# EAGLE design v4.1 (EAGLE 6.3)
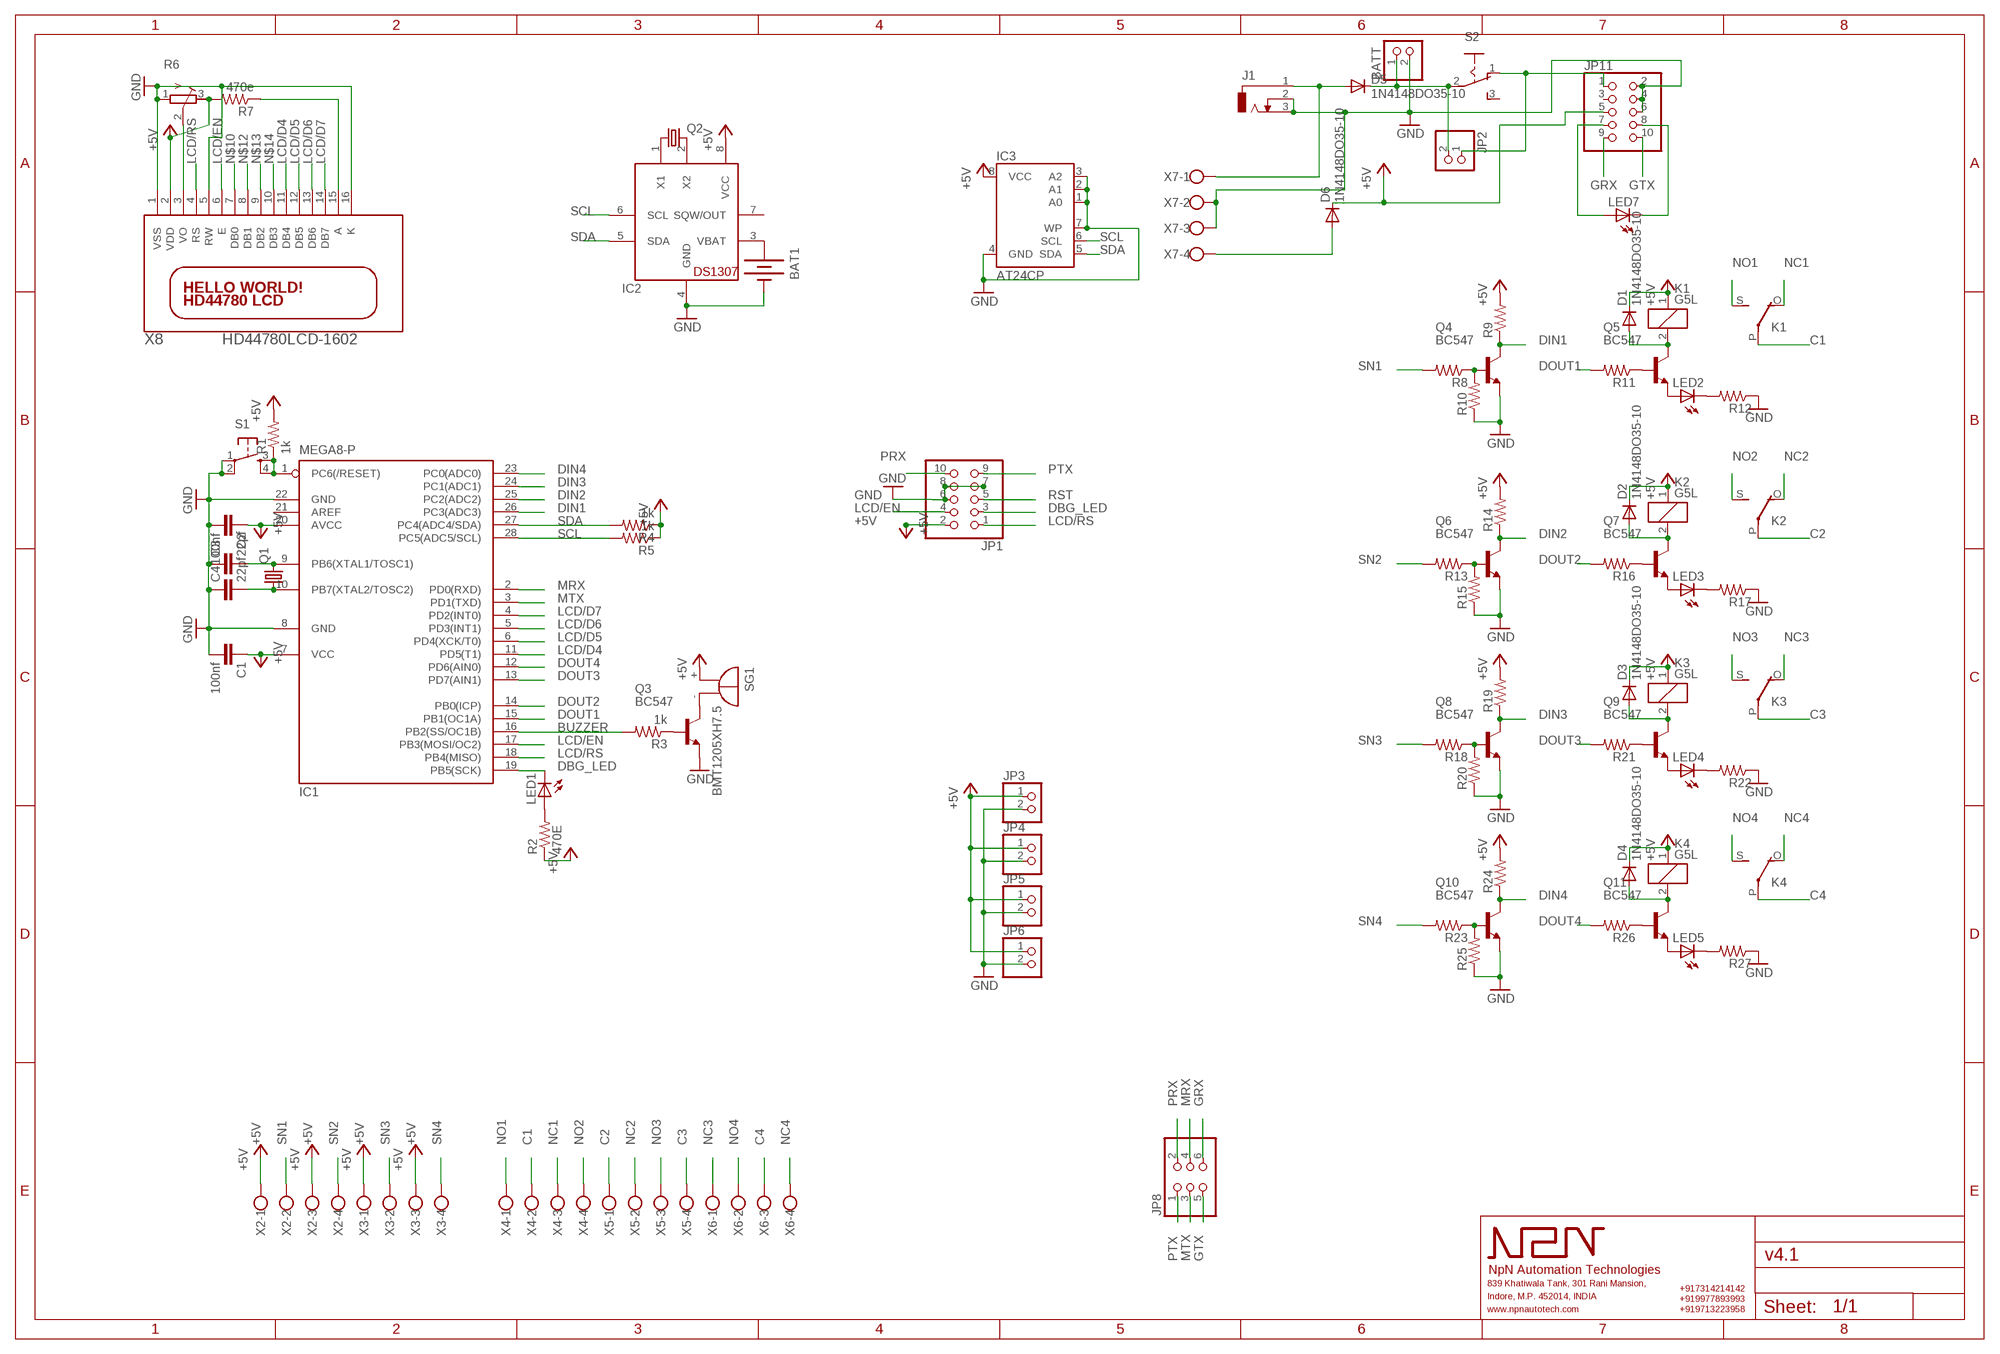
[diagram p0: schematic, sheet 1]

## Parts
BAT1  BATTERY20PTH  [BATTCOM_20MM_PTH]
BATT  PINHD-1X2  [1X02]
C1  100nf  C-EU050-025X075  [C050-025X075]
C2  100nf  C-EU050-025X075  [C050-025X075]
C3  22pf  C-EU050-025X075  [C050-025X075]
C4  22pf  C-EU050-025X075  [C050-025X075]
D1  1N4148DO35-10  [DO35-10]
D2  1N4148DO35-10  [DO35-10]
D3  1N4148DO35-10  [DO35-10]
D4  1N4148DO35-10  [DO35-10]
D5  1N4148DO35-10  [DO35-10]
D6  1N4148DO35-10  [DO35-10]
IC1  MEGA8-P  [DIL28-3]
IC2  DS1307  [DIL08]
IC3  AT24CP  [DIL08]
J1  DCJ0303  [DCJ0303]
JP1  PINHD-2X5/90  [2X05/90]
JP2  PINHD-1X2  [1X02]
JP3  PINHD-1X2  [1X02]
JP4  PINHD-1X2  [1X02]
JP5  PINHD-1X2  [1X02]
JP6  PINHD-1X2  [1X02]
JP8  PINHD-2X3/90  [2X03/90]
JP11  PINHD-2X5  [2X05]
K1  G5L  [G5LE]
K2  G5L  [G5LE]
K3  G5L  [G5LE]
K4  G5L  [G5LE]
LED1  LED5MM  [LED5MM]
LED2  LED5MM  [LED5MM]
LED3  LED5MM  [LED5MM]
LED4  LED5MM  [LED5MM]
LED5  LED5MM  [LED5MM]
LED7  LED5MM  [LED5MM]
Q1  CRYSTALHC49U-V  [HC49U-V]
Q2  CRYSTALTC38H  [TC38H]
Q3  BC547  [TO92]
Q4  BC547  [TO92]
Q5  BC547  [TO92]
Q6  BC547  [TO92]
Q7  BC547  [TO92]
Q8  BC547  [TO92]
Q9  BC547  [TO92]
Q10  BC547  [TO92]
Q11  BC547  [TO92]
R1  1k  R-US_0207/10  [0207/10]
R2  470E  R-US_0207/10  [0207/10]
R3  1k  R-US_0207/10  [0207/10]
R4  1k  R-US_0207/10  [0207/10]
R5  1k  R-US_0207/10  [0207/10]
R6  R-TRIMM3339P  [RTRIM3339P]
R7  470e  R-US_0207/10  [0207/10]
R8  R-US_0207/10  [0207/10]
R9  R-US_0207/10  [0207/10]
R10  R-US_0207/10  [0207/10]
R11  R-US_0207/10  [0207/10]
R12  R-US_0207/10  [0207/10]
R13  R-US_0207/10  [0207/10]
R14  R-US_0207/10  [0207/10]
R15  R-US_0207/10  [0207/10]
R16  R-US_0207/10  [0207/10]
R17  R-US_0207/10  [0207/10]
R18  R-US_0207/10  [0207/10]
R19  R-US_0207/10  [0207/10]
R20  R-US_0207/10  [0207/10]
R21  R-US_0207/10  [0207/10]
R22  R-US_0207/10  [0207/10]
R23  R-US_0207/10  [0207/10]
R24  R-US_0207/10  [0207/10]
R25  R-US_0207/10  [0207/10]
R26  R-US_0207/10  [0207/10]
R27  R-US_0207/10  [0207/10]
S1  TAC_SWITCHPTH  [TACTILE-PTH]
S2  M251  [M251]
SG1  BMT1205XH7.5  [BMT1205XH7.5]
X2  W237-4  [W237-4]
X3  W237-4  [W237-4]
X4  W237-4  [W237-4]
X5  W237-4  [W237-4]
X6  W237-4  [W237-4]
X7  W237-4  [W237-4]
X8  HD44780LCD-1602  [LCD1602]

## Nets
+5V: C1.1 C2.1 D1.C D2.C D3.C D4.C D6.C IC1.7(VCC) IC1.20(AVCC) IC2.8(VCC) IC3.8(VCC) JP1.2 JP3.1 JP4.1 JP5.1 JP6.1 JP11.5 K1.1 K2.1 K3.1 K4.1 R1.2 R2.1 R4.1 R5.1 R9.2 R14.2 R19.2 R24.2 SG1.+ X2.1 X2.3 X3.1 X3.3
BUZZER: IC1.16(PB2(SS/OC1B)) R3.2
C1: K1.P(2:P) X4.2
C2: K2.P(2:P) X5.1
C3: K3.P(2:P) X5.4
C4: K4.P(2:P) X6.3
DBG_LED: IC1.19(PB5(SCK)) JP1.3 LED1.K(C)
DIN1: IC1.26(PC3(ADC3)) Q4.3(C) R9.1
DIN2: IC1.25(PC2(ADC2)) Q6.3(C) R14.1
DIN3: IC1.24(PC1(ADC1)) Q8.3(C) R19.1
DIN4: IC1.23(PC0(ADC0)) Q10.3(C) R24.1
DOUT1: IC1.15(PB1(OC1A)) R11.2
DOUT2: IC1.14(PB0(ICP)) R16.2
DOUT3: IC1.13(PD7(AIN1)) R21.2
DOUT4: IC1.12(PD6(AIN0)) R26.2
GND: BAT1.2(-) BATT.2 C1.2 C2.2 C3.1 C4.1 IC1.8(GND) IC1.22(GND) IC2.4(GND) IC3.1(A0) IC3.2(A1) IC3.3(A2) IC3.4(GND) IC3.7(WP) J1.2 J1.3 JP1.6 JP1.7 JP1.8 JP3.2 JP4.2 JP5.2 JP6.2 JP11.2 JP11.4 JP11.6 Q3.1(E) Q4.1(E) Q6.1(E) Q8.1(E) Q10.1(E) R10.1 R12.1 R15.1 R17.1 R20.1 R22.1 R25.1 R27.1 S1.1 S1.2 X7.2 X7.3
GRX: JP8.6 JP11.9
GTX: JP8.5 JP11.10
LCD/D4: IC1.11(PD5(T1)) X8.11(DB4)
LCD/D5: IC1.6(PD4(XCK/T0)) X8.12(DB5)
LCD/D6: IC1.5(PD3(INT1)) X8.13(DB6)
LCD/D7: IC1.4(PD2(INT0)) X8.14(DB7)
LCD/EN: IC1.17(PB3(MOSI/OC2)) JP1.4 X8.6(E)
LCD/RS: IC1.18(PB4(MISO)) JP1.1 X8.4(RS)
MRX: IC1.2(PD0(RXD)) JP8.4
MTX: IC1.3(PD1(TXD)) JP8.3
N$1: IC2.2(X2) Q2.2
N$2: R7.1 X8.15(A)
N$3: IC2.1(X1) Q2.1
N$4: LED1.A R2.2
N$5: C3.2 IC1.9(PB6(XTAL1/TOSC1)) Q1.2
N$6: C4.2 IC1.10(PB7(XTAL2/TOSC2)) Q1.1
N$7: Q3.2(B) R3.1
N$8: Q3.3(C) SG1.-
N$9: R6.2(S) X8.3(VO)
N$10: X8.7(DB0)
N$11: BAT1.1(+) IC2.3(VBAT)
N$12: X8.8(DB1)
N$13: X8.9(DB2)
N$14: X8.10(DB3)
N$15: D6.A X7.4
N$16: Q4.2(B) R8.1 R10.2
N$17: JP2.1 JP11.1 S2.1(O)
N$18: Q5.2(B) R11.1
N$19: LED2.A Q5.1(E)
N$20: LED2.K(C) R12.2
N$21: D1.A K1.2 Q5.3(C)
N$22: D5.A J1.1 X7.1
N$23: BATT.1 D5.C JP2.2 S2.2(P)
N$27: Q6.2(B) R13.1 R15.2
N$28: Q7.2(B) R16.1
N$29: LED3.A Q7.1(E)
N$30: LED3.K(C) R17.2
N$31: D2.A K2.2 Q7.3(C)
N$32: Q8.2(B) R18.1 R20.2
N$33: Q9.2(B) R21.1
N$34: LED4.A Q9.1(E)
N$35: LED4.K(C) R22.2
N$36: D3.A K3.2 Q9.3(C)
N$37: Q10.2(B) R23.1 R25.2
N$38: Q11.2(B) R26.1
N$39: LED5.A Q11.1(E)
N$40: LED5.K(C) R27.2
N$41: D4.A K4.2 Q11.3(C)
N$50: JP11.7 LED7.A
N$51: JP11.8 LED7.K(C)
NC1: K1.O(2:O) X4.3
NC2: K2.O(2:O) X5.2
NC3: K3.O(2:O) X6.1
NC4: K4.O(2:O) X6.4
NO1: K1.S(2:S) X4.1
NO2: K2.S(2:S) X4.4
NO3: K3.S(2:S) X5.3
NO4: K4.S(2:S) X6.2
PRX: JP1.10 JP8.2
PTX: JP1.9 JP8.1
RST: IC1.1(PC6(/RESET)) JP1.5 R1.1 S1.3 S1.4
SCL: IC1.28(PC5(ADC5/SCL)) IC2.6(SCL) IC3.6(SCL) R5.2
SDA: IC1.27(PC4(ADC4/SDA)) IC2.5(SDA) IC3.5(SDA) R4.2
SN1: R8.2 X2.2
SN2: R13.2 X2.4
SN3: R18.2 X3.2
SN4: R23.2 X3.4
VDD: R6.3(E) R7.2 X8.2(VDD) ; supply symbol labelled +5V
VSS: R6.1(A) X8.1(VSS) X8.5(RW) X8.16(K) ; supply symbol labelled GND
Unconnected: IC1.21(AREF) IC2.7(SQW/OUT) JP11.3 S2.3(S)

## Library data of the parts
BAT1 = SparkFun-Electromechanical:BATTERY: Battery Holders Various common sizes : AA, AAA, 20mm coin cell and 12mm coin cell. 20MM_4LEGS, BATT-10373
BATT JP2-JP6 = pinhead:PINHD-1X2: PIN HEADER
C1-C4 = rcl:C-EU: CAPACITOR, European symbol
D1-D6 = diode:1N4148: DIODE high speed (Philips)
IC1 = atmel:MEGA8-P: MICROCONTROLLER 8 Kbytes FLASH, 1 kbytes SRAM, 512 bytes EEPROM, USART, 4-channel 10 bit ADC, 2-channel 8 bit ADC Pin compatible with Atmega48, ATMega88, ATMega168 Source: avr.lbr; OC_FARNELL: unknown; OC_NEWARK: unknown
IC2 = adafruit:DS1307: DS1307 Real time clock (RTC) with battery backup ability. Talk to it via i2c
IC3 = atmel:AT24C*: 2-wire serial EEPROM; MPN: AT24C1024BW-SH-B; OC_FARNELL: 1362646; OC_NEWARK: 03P2044
J1 = con-jack:DCJ0303: DC POWER JACK Source: DCJ0303.pdf; OC_FARNELL: unknown; OC_NEWARK: unknown
JP1 JP11 = pinhead:PINHD-2X5: PIN HEADER
JP8 = pinhead:PINHD-2X3: PIN HEADER
K1-K4 = relay:G5L: RELAY 1 x switch, 10 A/120 V AC, 8 A/30 V ADC, Omron; OC_FARNELL: unknown; OC_NEWARK: unknown
LED1-LED5 LED7 = led:LED: LED OSRAM: - CHIPLED LG R971, LG N971, LY N971, LG Q971, LY Q971, LO R971, LY R971 LH N974, LH R974 LS Q976, LO Q976, LY Q976 LO Q996 - Hyper CHIPLED LW Q18S LB Q993, LB Q99A, LB R99A - SideLED LS A670, LO A670, LY A670, LG A670, LP A670 LB A673, LV A673, LT A673, LW A673 LH A674 LY A675 LS A676, LA A676, LO A676, LY A676, LW A676 LS A679, LY A679, LG A679 - Hyper Micro SIDELED® LS Y876, LA Y876, LO Y876, LY Y876 LT Y87S - SmartLED LW L88C, LW L88S LB L89C, LB L89S, LG L890 LS L89K, LO L89K, LY L89K LS L896, LA L896, LO L896, LY L896 - TOPLED LS T670, LO T670, LY T670, LG T670, LP T670 LSG T670, LSP T670, LSY T670, LOP T670, LYG T670 LG T671, LOG T671, LSG T671 LB T673, LV T673, LT T673, LW T673 LH T674 LS T676, LA T676, LO T676, LY T676, LB T676, LH T676, LSB T676, LW T676 LB T67C, LV T67C, LT T67C, LS T67K, LO T67K, LY T67K, LW E67C LS E67B, LA E67B, LO E67B, LY E67B, LB E67C, LV E67C, LT E67C LW T67C LS T679, LY T679, LG T679 LS T770, LO T770, LY T770, LG T770, LP T770 LB T773, LV T773, LT T773, LW T773 LH T774 LS E675, LA E675, LY E675, LS T675 LS T776, LA T776, LO T776, LY T776, LB T776 LHGB T686 LT T68C, LB T68C - Hyper Mini TOPLED® LB M676 - Mini TOPLED Santana® LG M470 LS M47K, LO M47K, LY M47K Source: http://www.osram.convergy.de LUXEON: - LUMILED® LXK2-PW12-R00, LXK2-PW12-S00, LXK2-PW14-U00, LXK2-PW14-V00 LXK2-PM12-R00, LXK2-PM12-S00, LXK2-PM14-U00 LXK2-PE12-Q00, LXK2-PE12-R00, LXK2-PE12-S00, LXK2-PE14-T00, LXK2-PE14-U00 LXK2-PB12-K00, LXK2-PB12-L00, LXK2-PB12-M00, LXK2-PB14-N00, LXK2-PB14-P00, LXK2-PB14-Q00 LXK2-PR12-L00, LXK2-PR12-M00, LXK2-PR14-Q00, LXK2-PR14-R00 LXK2-PD12-Q00, LXK2-PD12-R00, LXK2-PD12-S00 LXK2-PH12-R00, LXK2-PH12-S00 LXK2-PL12-P00, LXK2-PL12-Q00, LXK2-PL12-R00 Source: www.luxeon.com KINGBRIGHT: KA-3528ASYC Source: www.kingbright.com
Q1 = crystal:CRYSTAL: CRYSTAL; OC_FARNELL: 1666969; OC_NEWARK: unknown
Q2 = crystal:CRYSTAL: CRYSTAL; OC_FARNELL: unknown; OC_NEWARK: unknown
Q3-Q11 = transistor-npn:BC547*: NPN Transistor
R1-R5 R7-R27 = rcl:R-US_: RESISTOR, American symbol
R6 = rcl:R-TRIMM: Trimm resistor
S1 = SparkFun-Electromechanical:TAC_SWITCH: Momentary Switch Button commonly used for reset or general input. Spark Fun Electronics SKU : COM-00097 SMT- SWCH-08247
S2 = switch:M251: SLIDING SWITCH Mors, distributor Buerklin, 11G702
SG1 = buzzer:BMT1205XH7.5: MAGNETIC TRANSDUCER Source: Http:www.be-star.com; OC_FARNELL: unknown; OC_NEWARK: unknown
X2-X7 = con-wago-500:W237-4: WAGO SCREW CLAMP; OC_FARNELL: unknown; OC_NEWARK: unknown
X8 = adafruit_NPN:HD44780LCD: HD44780 LCD Standard character type LCDs, available in sizes from 8x1 to 40x4!

## Board
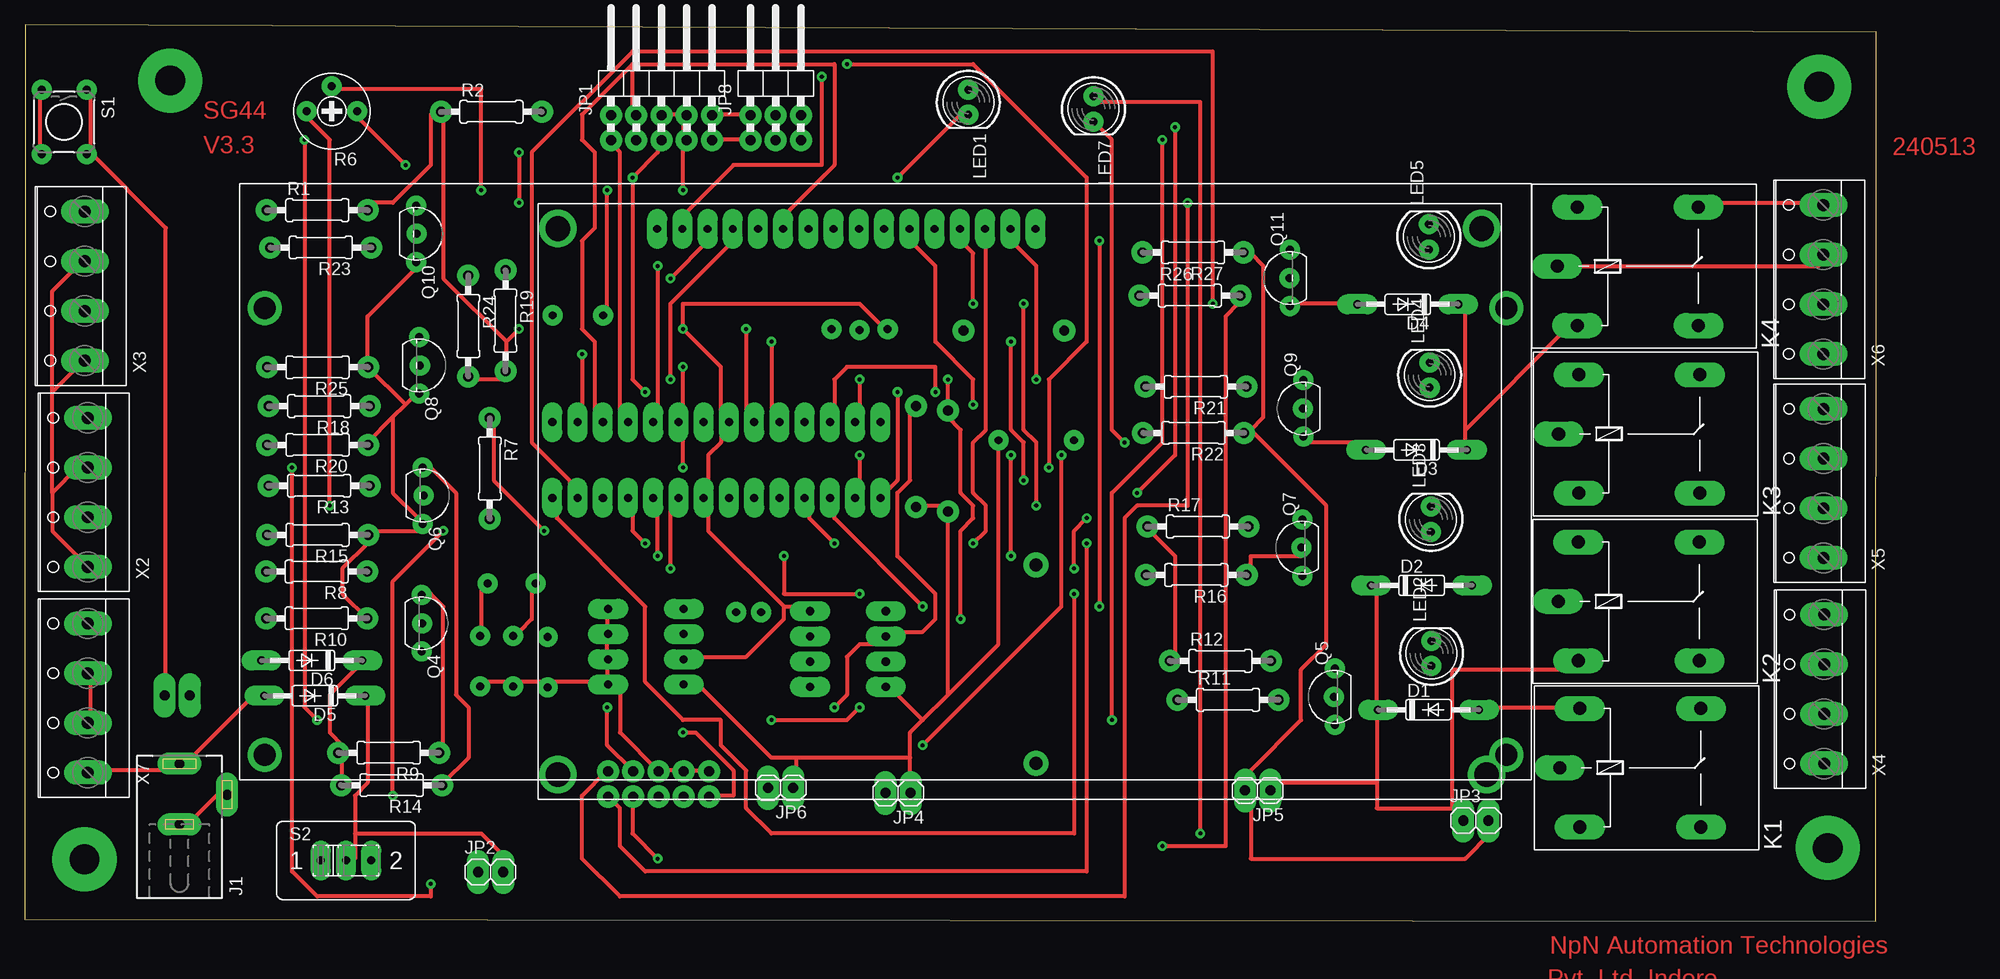
[diagram p1: board, top side]
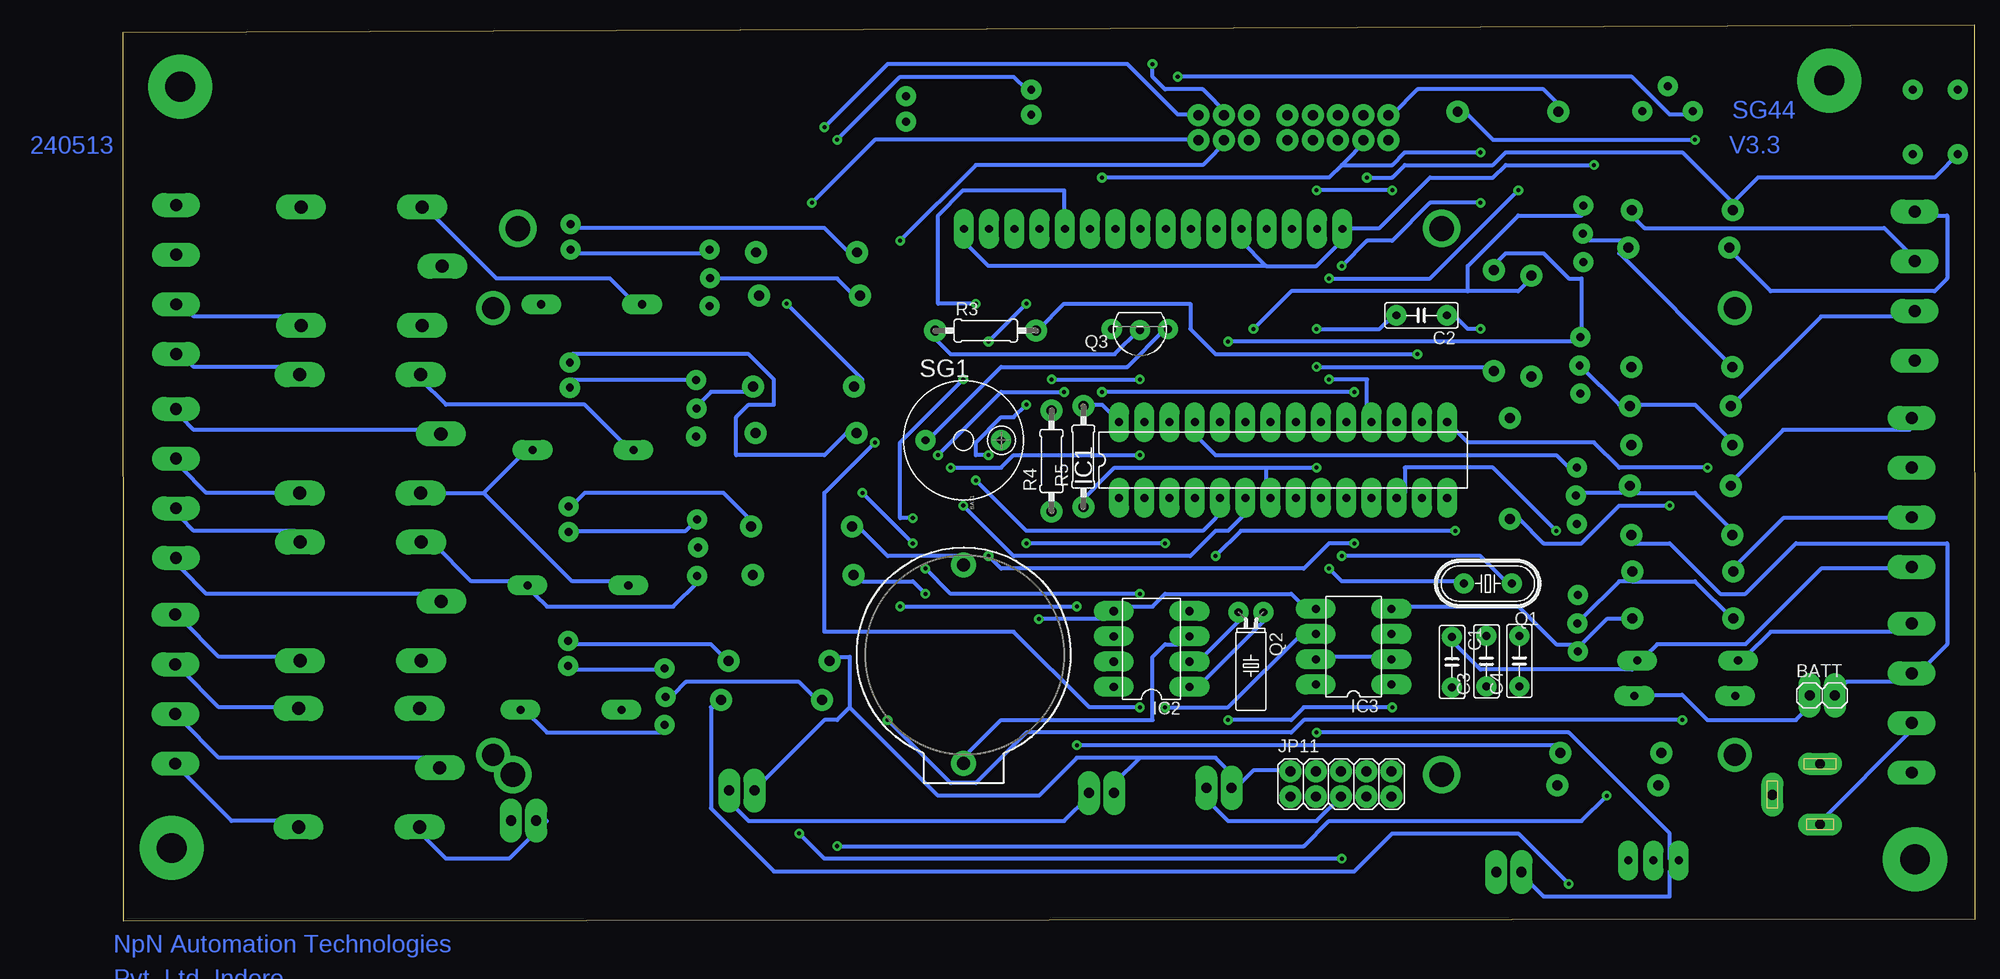
[diagram p2: board, bottom side, seen from below]

Size 186.4 x 90.27 mm. Coordinates in mm from the lower left corner, seen from the top.
Outline: 0,0.18 186.35,0 186.4,89.5 0.05,90.27 0,0.18
Copper layers (1*16): Top 0.035mm / dielectric 1.5mm / Bottom 0.035mm
Design rules: minimum track width 16mil, minimum drill 16mil, track to track 16mil, track to pad 16mil, pad to pad 16mil, via to via 16mil, smd to smd 16mil, copper to edge 40mil, drill to drill 16mil, minimum pad ring 24mil, minimum via ring 11mil, stop-mask expansion 16mil, vias tented up to drill 0mil, thermal gap 16mil

### Footprints (pad centres in the part's own frame; a part is rotated, then mirrored left to right if it is on the bottom)
BATTCOM_20MM_PTH = drill 1.3: 1 20,0; 2 0,0
1X02 = drill 1.016 long: 1 -1.27,0; 2 1.27,0
C050-025X075 = drill 0.8 pad 1.93: 1 -2.54,0; 2 2.54,0
DO35-10 = drill 0.813 long: A 5.08,0; C -5.08,0
DIL28-3 = drill 0.813 long: 1 -16.51,-3.81; 2 -13.97,-3.81; 3 -11.43,-3.81; 4 -8.89,-3.81; 5 -6.35,-3.81; 6 -3.81,-3.81; 7 -1.27,-3.81; 8 1.27,-3.81; 9 3.81,-3.81; 10 6.35,-3.81; 11 8.89,-3.81; 12 11.43,-3.81; 13 13.97,-3.81; 14 16.51,-3.81; 15 16.51,3.81; 16 13.97,3.81; 17 11.43,3.81; 18 8.89,3.81; 19 6.35,3.81; 20 3.81,3.81; 21 1.27,3.81; 22 -1.27,3.81; 23 -3.81,3.81; 24 -6.35,3.81; 25 -8.89,3.81; 26 -11.43,3.81; 27 -13.97,3.81; 28 -16.51,3.81
DIL08 = drill 0.813 long: 1 -3.81,-3.81; 2 -1.27,-3.81; 3 1.27,-3.81; 4 3.81,-3.81; 5 3.81,3.81; 6 1.27,3.81; 7 -1.27,3.81; 8 -3.81,3.81
DCJ0303 = drill 1 pad 2 long: 1 0,3.1; 2 4.8,0; 3 0,-3
2X05/90 = drill 1 pad 2.184: 1 -5.08,-6.35; 2 -5.08,-3.81; 3 -2.54,-6.35; 4 -2.54,-3.81; 5 0,-6.35; 6 0,-3.81; 7 2.54,-6.35; 8 2.54,-3.81; 9 5.08,-6.35; 10 5.08,-3.81
2X03/90 = drill 1 pad 2.184: 1 -2.54,-6.35; 2 -2.54,-3.81; 3 0,-6.35; 4 0,-3.81; 5 2.54,-6.35; 6 2.54,-3.81
2X05 = drill 1 pad 2.184: 1 -5.08,-1.27; 2 -5.08,1.27; 3 -2.54,-1.27; 4 -2.54,1.27; 5 0,-1.27; 6 0,1.27; 7 2.54,-1.27; 8 2.54,1.27; 9 5.08,-1.27; 10 5.08,1.27
G5LE = drill 1.321 long: 1 -7.493,-5.969; 2 -7.493,5.969; O 4.699,5.969; P -9.525,0; S 4.699,-5.969
LED5MM = drill 0.8 pad 1.778: A -1.27,0; K 1.27,0
HC49U-V = drill 0.8 pad 1.93: 1 -2.413,0; 2 2.413,0
TC38H = drill 0.8 pad 1.93: 1 -1.27,0; 2 1.27,0
TO92 = drill 0.8 pad 1.93: 1 2.84,0; 2 0,0.075; 3 -2.84,0
0207/10 = drill 1 pad 2.184: 1 -5.08,0; 2 5.08,0
RTRIM3339P = drill 0.8 pad 1.93: 1 -2.54,0; 2 0,-2.54; 3 2.54,0
TACTILE-PTH = drill 0.8 pad 1.93: 1 -3.251,2.261; 2 3.251,2.261; 3 -3.251,-2.261; 4 3.251,-2.261
M251 = drill 0.813 long: 1 -2.54,0; 2 0,0; 3 2.54,0
BMT1205XH7.5 = drill 0.8 pad 1.93: + 3.8,0; - -3.8,0
SIM300_OUTLINE = drill 2.2: P$1 2.5,2.5; P$2 2.5,47.5; P$3 127.5,2.5; P$4 127.5,47.5
W237-4 = drill 1.194 long: 1 -7.5,-1.27; 2 -2.5,-1.27; 3 2.5,-1.27; 4 7.5,-1.27
LCD1602 = drill 0.8 long: 1 12,57.96; 2 14.54,57.96; 3 17.08,57.96; 4 19.62,57.96; 5 22.16,57.96; 6 24.7,57.96; 7 27.24,57.96; 8 29.78,57.96; 9 32.32,57.96; 10 34.86,57.96; 11 37.4,57.96; 12 39.94,57.96; 13 42.48,57.96; 14 45.02,57.96; 15 47.56,57.96; 16 50.1,57.96 | drill 2.5: P$1 2,58; P$2 95,58; P$3 2,3; P$4 95.5,3

### Placement (x,y rotation side)
BAT1  101.77,35.89 270 bottom
BATT  15.35,22.74 0 bottom
C1  52.61,26.1 270 bottom
C2  55.69,61.02 180 bottom
C3  49.14,26.18 90 bottom
C4  45.83,26.2 90 bottom
D1  141.31,21.31 0 top
D2  140.61,33.82 0 top
D3  140.1,47.47 180 top
D4  139.22,62.13 180 top
D5  29.19,22.71 180 top
D6  28.9,26.26 180 top
IC1  69.62,46.45 0 bottom
IC2  82.86,27.42 90 bottom
IC3  62.52,27.65 90 bottom
J1  15.56,12.75 0 top
JP1  64.09,85 0 top
JP2  46.89,4.96 0 top
JP3  146.08,10.14 0 top
JP4  87.91,12.91 180 top
JP5  124.11,13.16 180 top
JP6  76.08,13.43 180 top
JP8  75.59,85 0 top
JP11  63.78,13.83 0 bottom
K1  164.04,15.46 0 top
K2  163.89,32.21 0 top
K3  163.93,49.08 0 top
K4  163.79,65.96 0 top
LED1  94.98,82.47 270 top
LED2  141.62,26.97 90 top
LED3  141.55,40.48 90 top
LED4  141.42,54.99 90 top
LED5  141.34,68.92 90 top
LED7  107.58,81.8 270 top
Q1  49.01,34.01 180 bottom
Q2  72.85,31.13 180 bottom
Q3  84.03,59.63 180 bottom
Q4  39.93,30.01 270 top
Q5  131.87,22.6 90 top
Q6  40.06,42.87 270 top
Q7  128.59,37.62 90 top
Q8  39.7,55.98 270 top
Q9  128.74,51.64 90 top
Q10  39.38,69.23 270 top
Q11  127.37,64.78 90 top
R1  29.45,71.6 0 top
R2  46.97,81.51 0 top
R3  99.56,59.48 0 bottom
R4  92.93,46.35 90 bottom
R5  89.73,46.78 90 bottom
R6  30.91,81.57 180 top
R7  46.81,45.59 270 top
R8  29.39,35.22 180 top
R9  36.63,16.98 180 top
R10  29.4,30.51 180 top
R11  121.13,22.3 0 top
R12  120.35,26.23 0 top
R13  29.63,43.86 180 top
R14  36.92,13.71 180 top
R15  29.47,38.91 180 top
R16  117.93,34.86 180 top
R17  118.08,39.75 0 top
R18  29.64,51.88 180 top
R19  48.39,60.48 270 top
R20  29.48,47.98 180 top
R21  117.88,53.83 180 top
R22  117.65,49.19 180 top
R23  29.8,67.85 180 top
R24  44.65,59.94 270 top
R25  29.47,55.79 180 top
R26  117.28,63 0 top
R27  117.6,67.36 180 top
S1  3.95,80.48 270 top
S2  32.33,6.12 0 top
SG1  101.8,48.43 0 bottom
U$1  SIM300_OUTLINE  [SIM300_OUTLINE]  21.65,14.26 0 top
X2  5.07,43.18 90 top
X3  4.77,63.96 90 top
X4  179.87,23.38 90 top
X5  179.8,44.09 90 top
X6  179.79,64.62 90 top
X7  5.07,22.48 90 top
X8  51.65,11.76 0 top

### Tracks (layer width: path | path; a pad name or v marks a point on that pad's centre or on a via)
+5V  (via drill 0.41)
  Top 0.406: R14.2 31.97,13.92 31.97,16.46 R9.2 31.97,17.73 30.7,19 30.7,22.81 33.24,25.35 D6.C | 2.76,43.13 2.76,39.32 5.3,36.78 X2.1 | 2.76,43.13 5.3,45.67 X2.3 | 2.76,53.29 5.3,55.83 X3.1 | 2.76,43.13 2.76,53.29 | 2.76,53.29 2.76,63.45 5.3,65.99 X3.3 | 48.48,58.37 v49.75,59.64 | 48.48,58.37 48.48,55.83 R19.2 48.48,54.56 44.67,54.56 R24.2 | R1.2 34.51,72.34 37.05,72.34 40.86,76.15 40.86,81.23 R2.1 42.13,81.23 42.13,64.72 48.48,58.37 | v66.26,45.67 66.26,49.48 IC1.20 66.26,50.75 v66.26,55.83 | R5.1 90.39,41.86 92.93,41.86 R4.1 92.93,40.59 92.93,22.81 | 77.69,16.46 75.15,16.46 67.53,24.08 IC3.8 | 77.69,16.46 77.69,13.92 JP6.1 | 90.39,20.27 89.12,19 89.12,16.46 | 90.39,20.27 92.93,22.81 | 92.93,22.81 98.01,27.89 98.01,48.21 SG1.+ | 89.12,16.46 89.12,13.92 JP4.1 | 90.39,20.27 87.85,22.81 IC2.8 | 89.12,16.46 77.69,16.46 | 145,49.48 145,48.21 D3.C | 145,49.48 145,62.18 D4.C | 145,49.48 155.16,59.64 K4.1 | 136.11,21.54 136.11,32.97 D2.C | 136.11,13.92 125.95,13.92 JP5.1 | 136.11,21.54 136.11,13.92 | 136.11,21.54 D1.C | 143.73,11.38 136.11,11.38 136.11,13.92 | 143.73,11.38 143.73,25.35 155.16,25.35 K2.1 | 143.73,11.38 JP3.1
  Bottom 0.406: C1.1 52.29,27.89 49.75,25.35 34.51,25.35 D6.C 33.24,26.62 31.97,27.89 23.08,27.89 15.46,35.51 6.57,35.51 X2.1 | v49.75,59.64 51.02,59.64 52.29,60.91 C2.1 | JP1.2 58.64,81.23 56.1,83.77 43.4,83.77 42.13,82.5 R2.1 | X3.3 6.57,67.26 9.11,69.8 33.24,69.8 34.51,71.07 R1.2 | 71.34,45.67 71.34,43.13 IC1.7 | 71.34,45.67 86.58,45.67 90.39,41.86 R5.1 | 71.34,45.67 v66.26,45.67 | JP11.5 63.72,12.65 66.26,10.11 75.15,10.11 77.69,12.65 JP6.1 | 150.08,43.13 146.27,46.94 D3.C | 150.08,43.13 156.43,43.13 K3.1 | K1.1 156.43,8.84 153.89,6.3 147.54,6.3 143.73,10.11 JP3.1 | 150.08,43.13 141.19,34.24 136.11,34.24 D2.C | JP4.1 89.12,12.65 91.66,10.11 123.41,10.11 125.95,12.65 JP5.1 | v66.26,55.83 48.48,55.83 R19.2
BUZZER  (via drill 0.41)
  Top 0.406: v56.1,57.1 56.1,50.75 IC1.16
  Bottom 0.406: v56.1,57.1 76.42,57.1 78.96,59.64 78.96,62.18 91.66,62.18 94.2,59.64 R3.2
C1
  Bottom 0.406: X4.2 180.56,20.27 176.75,16.46 155.16,16.46 K1.P
C2
  Bottom 0.406: X5.1 180.56,35.51 178.02,32.97 155.16,32.97 K2.P
C3
  Bottom 0.406: X5.4 180.56,50.75 179.29,49.48 155.16,49.48 K3.P
C4
  Top 0.406: X6.3 180.56,65.99 155.16,65.99 K4.P
DBG_LED  (via drill 0.41)
  Top 0.406: v87.85,74.88 94.2,81.23 LED1.K | v63.72,65.99 63.72,50.75 IC1.19 | v49.75,77.42 v49.75,72.34
  Bottom 0.406: v87.85,74.88 64.99,74.88 63.72,76.15 | 63.72,76.15 61.18,78.69 JP1.3 | v63.72,65.99 61.18,68.53 58.64,68.53 54.83,72.34 v49.75,72.34 | v49.75,77.42 57.37,77.42 58.64,76.15 63.72,76.15
DIN1  (via drill 0.41)
  Top 0.406: Q4.3 40.86,32.97 42.13,31.7 42.13,17.73 R9.1 | v91.66,53.29 91.66,55.83 82.77,55.83 81.5,54.56 81.5,50.75 IC1.26 | v104.36,46.94 104.36,31.7 v90.39,17.73
  Bottom 0.406: v91.66,53.29 98.01,53.29 v104.36,46.94 | v90.39,17.73 42.13,17.73 R9.1
DIN2
  Top 0.406: R14.1 42.13,13.92 44.67,16.46 44.67,21.54 43.4,22.81 43.4,43.13 40.86,45.67 Q6.3
  Bottom 0.406: Q6.3 40.86,45.67 42.13,46.94 76.42,46.94 78.96,49.48 IC1.25
DIN3  (via drill 0.41)
  Top 0.406: v75.15,58.37 75.15,50.75 IC1.24
  Bottom 0.406: R19.1 48.48,65.99 47.21,67.26 43.4,67.26 40.86,64.72 39.59,64.72 39.59,59.64 Q8.3 39.59,58.37 v75.15,58.37
DIN4  (via drill 0.41)
  Top 0.406: v72.61,59.64 72.61,50.75 IC1.23
  Bottom 0.406: 51.02,63.45 51.02,65.99 45.94,71.07 39.59,71.07 Q10.3 | 51.02,63.45 45.94,63.45 44.67,64.72 R24.1 | v72.61,59.64 68.8,63.45 51.02,63.45
DOUT1  (via drill 0.41)
  Top 0.406: v26.89,45.67 26.89,5.03 29.43,2.49 40.86,2.49 v40.86,3.76
  Bottom 0.406: v26.89,45.67 35.78,45.67 38.32,48.21 51.02,48.21 52.29,49.48 IC1.15 | v40.86,3.76 45.94,8.84 58.64,8.84 62.45,5.03 120.87,5.03 127.22,11.38 127.22,21.54 125.95,21.54 R11.2
DOUT2  (via drill 0.41)
  Top 0.406: v105.63,32.97 105.63,8.84 75.15,8.84 72.61,11.38 72.61,15.19 70.07,17.73 70.07,20.27 66.26,20.27 62.45,24.08 62.45,31.7 53.56,40.59 53.56,41.86 IC1.14
  Bottom 0.406: v105.63,32.97 106.9,34.24 111.98,34.24 R16.2
DOUT3  (via drill 0.41)
  Top 0.406: v119.6,62.18 119.6,87.58 61.18,87.58 51.02,77.42 51.02,48.21 54.83,44.4 54.83,43.13 IC1.13
  Bottom 0.406: v119.6,62.18 111.98,54.56 R21.2
DOUT4  (via drill 0.41)
  Top 0.406: v42.13,39.32 37.05,34.24 v37.05,12.65 | v114.52,7.57 120.87,7.57 120.87,60.91 122.14,62.18 R26.2
  Bottom 0.406: v42.13,39.32 48.48,45.67 57.37,45.67 57.37,43.13 IC1.12 | v37.05,12.65 39.59,10.11 64.99,10.11 67.53,7.57 v114.52,7.57
GND  (via drill 0.41)
  Top 0.406: 123.41,49.48 124.68,50.75 124.68,65.99 123.41,67.26 R27.1 | R12.1 115.79,26.62 115.79,36.78 113.25,39.32 R17.1 | JP3.2 147.54,10.11 147.54,8.84 145,6.3 123.41,6.3 123.41,12.65 JP5.2 123.41,13.92 123.41,15.19 128.49,20.27 128.49,25.35 131.03,27.89 131.03,41.86 123.41,49.48 | 123.41,49.48 R22.1 | J1.3 16.73,10.11 19.27,12.65 J1.2 | 6.57,77.42 6.57,83.77 S1.1 | X7.2 6.57,20.27 6.57,24.08 X7.3 | 6.57,77.42 14.19,69.8 14.19,22.81 BATT.2 | 6.57,77.42 S1.2 | 66.26,81.23 66.26,78.69 | 66.26,81.23 64.99,81.23 JP1.6 | 66.26,81.23 JP1.8 | Q3.1 86.58,59.64 84.04,62.18 66.26,62.18 v66.26,59.64 70.07,55.83 70.07,50.75 IC1.22 70.07,49.48 70.07,48.21 68.8,46.94 68.8,43.13 IC1.8 68.8,41.86 68.8,39.32 76.42,31.7 | 76.42,31.7 78.96,31.7 IC2.4 | v66.26,73.61 66.26,78.69 | v58.64,73.61 58.64,60.91 C2.2 | 66.26,78.69 JP1.7 | 34.51,55.83 34.51,60.91 39.59,65.99 Q10.1 | 37.05,50.75 34.51,48.21 R20.1 | 37.05,50.75 38.32,52.02 | 38.32,52.02 39.59,53.29 Q8.1 | 37.05,50.75 37.05,43.13 39.59,40.59 Q6.1 39.59,39.32 34.51,39.32 R15.1 34.51,38.05 31.97,35.51 31.97,32.97 34.51,30.43 R10.1 | 38.32,52.02 34.51,55.83 | 34.51,55.83 R25.1 | 66.26,15.19 63.72,15.19 | 66.26,15.19 68.8,15.19 JP11.2 | 66.26,15.19 JP11.4 | 52.29,24.08 49.75,24.08 C3.1 48.48,24.08 45.94,24.08 C4.1 | 58.64,29.16 58.64,31.7 IC3.4 | 58.64,26.62 58.64,24.08 | 58.64,26.62 58.64,29.16 | 58.64,29.16 IC3.3 | 58.64,26.62 IC3.2 | 58.64,24.08 52.29,24.08 | 52.29,24.08 C1.2 | 58.64,24.08 IC3.1 59.91,24.08 59.91,19 63.72,15.19 | 63.72,15.19 JP11.6 | 76.42,31.7 76.42,30.43 72.61,26.62 67.53,26.62 IC3.7
  Bottom 0.406: R17.1 111.98,39.32 109.44,36.78 101.82,36.78 BAT1.2 | 113.25,21.54 114.52,20.27 115.79,20.27 122.14,13.92 JP5.2 | 113.25,21.54 113.25,26.62 114.52,26.62 R12.1 | BATT.2 14.19,22.81 12.92,24.08 6.57,24.08 X7.3 5.3,25.35 2.76,27.89 2.76,38.05 18,38.05 23.08,32.97 25.62,32.97 30.7,38.05 34.51,38.05 R15.1 | J1.3 15.46,10.11 6.57,19 X7.2 | v66.26,59.64 59.91,59.64 58.64,60.91 C2.2 | v58.64,73.61 v66.26,73.61 | 39.59,27.89 37.05,30.43 34.51,30.43 R10.1 | 73.88,13.92 72.61,15.19 68.8,15.19 JP11.2 | 84.04,16.46 86.58,13.92 JP4.2 | 84.04,16.46 76.42,16.46 73.88,13.92 | 73.88,13.92 JP6.2 | IC3.7 66.26,26.62 59.91,26.62 IC3.2 | 39.59,27.89 42.13,27.89 45.94,31.7 58.64,31.7 IC3.4 | 39.59,27.89 Q4.1 | 113.25,21.54 104.36,12.65 94.2,12.65 90.39,16.46 84.04,16.46
GRX  (via drill 0.41)
  Top 0.406: v106.9,38.05 106.9,5.03 62.45,5.03 59.91,7.57 59.91,11.38 58.64,12.65 JP11.9 | v111.98,43.13 115.79,46.94 v115.79,79.96
  Bottom 0.406: v111.98,43.13 v106.9,38.05 | v115.79,79.96 109.44,86.31 85.31,86.31 80.23,81.23 78.96,81.23 JP8.6
GTX  (via drill 0.41)
  Top 0.406: v117.06,72.34 117.06,41.86 111.98,41.86 110.71,40.59 110.71,2.49 59.91,2.49 56.1,6.3 56.1,12.65 58.64,15.19 JP11.10
  Bottom 0.406: v117.06,72.34 110.71,78.69 78.96,78.69 JP8.5
LCD/D4  (via drill 0.41)
  Top 0.406: v95.47,52.02 95.47,54.56 91.66,58.37 91.66,65.99 89.12,68.53 X8.11 | v99.28,36.78 v99.28,46.94 | v62.45,38.05 61.18,39.32 61.18,41.86 IC1.11
  Bottom 0.406: v95.47,52.02 96.74,50.75 98.01,50.75 100.55,48.21 100.55,46.94 v99.28,46.94 | v99.28,36.78 98.01,35.51 67.53,35.51 64.99,38.05 v62.45,38.05
LCD/D5  (via drill 0.41)
  Top 0.406: v100.55,62.18 100.55,49.48 101.82,48.21 v101.82,41.86
  Bottom 0.406: v100.55,62.18 104.36,62.18 104.36,71.07 101.82,73.61 91.66,73.61 91.66,69.8 X8.12 | v101.82,41.86 96.74,36.78 78.96,36.78 76.42,39.32 75.15,39.32 72.61,41.86 IC1.6
LCD/D6  (via drill 0.41)
  Top 0.406: v95.47,62.18 95.47,67.26 94.2,68.53 X8.13 | v99.28,58.37 99.28,49.48 100.55,48.21 v100.55,44.4
  Bottom 0.406: v99.28,58.37 v95.47,62.18 | v100.55,44.4 95.47,39.32 77.69,39.32 75.15,41.86 IC1.5
LCD/D7  (via drill 0.41)
  Top 0.406: v95.47,38.05 96.74,39.32 96.74,41.86 95.47,43.13 95.47,48.21 96.74,49.48 96.74,68.53 X8.14 | v81.5,38.05 78.96,40.59 78.96,41.86 IC1.4
  Bottom 0.406: v81.5,38.05 v95.47,38.05
LCD/EN
  Top 0.406: 61.18,86.31 81.5,86.31 81.5,76.15 76.42,71.07 76.42,69.8 X8.6 | 61.18,86.31 61.18,81.23 JP1.4 | 61.18,86.31 56.1,81.23 56.1,78.69 57.37,77.42 57.37,69.8 56.1,68.53 56.1,59.64 57.37,58.37 57.37,50.75 IC1.17
LCD/RS  (via drill 0.41)
  Top 0.406: v64.99,54.56 64.99,62.18 71.34,68.53 X8.4 | JP1.1 58.64,78.69 59.91,77.42 59.91,50.75 IC1.18
  Bottom 0.406: v64.99,54.56 61.18,54.56 61.18,50.75 IC1.18
MRX  (via drill 0.41)
  Top 0.406: v84.04,46.94 84.04,43.13 IC1.2 | v103.09,45.67 103.09,54.56 106.9,58.37 106.9,74.88 95.47,86.31 v82.77,86.31
  Bottom 0.406: v84.04,46.94 96.74,46.94 98.01,45.67 v103.09,45.67 | v82.77,86.31 82.77,85.04 81.5,83.77 77.69,83.77 75.15,81.23 JP8.4
MTX  (via drill 0.41)
  Top 0.406: v90.39,31.7 81.5,40.59 81.5,41.86 IC1.3 | v108.17,68.53 v108.17,31.7
  Bottom 0.406: v108.17,31.7 v90.39,31.7 | v108.17,68.53 100.55,76.15 77.69,76.15 75.15,78.69 JP8.3
N$1
  Bottom 0.406: Q2.2 73.88,30.43 77.69,26.62 78.96,26.62 IC2.2
N$2  (via drill 0.41)
  Top 0.406: v101.82,54.56 101.82,65.99 99.28,68.53 X8.15 | v106.9,40.59 105.63,39.32 v105.63,35.51 | v84.04,32.97 76.42,32.97 v76.42,36.78 | v52.29,39.32 47.21,44.4 47.21,50.75 R7.1
  Bottom 0.406: v101.82,54.56 108.17,48.21 108.17,40.59 v106.9,40.59 | v105.63,35.51 103.09,32.97 v84.04,32.97 | v76.42,36.78 73.88,39.32 v52.29,39.32
N$3
  Bottom 0.406: Q2.1 71.34,30.43 77.69,24.08 78.96,24.08 IC2.1
N$4  (via drill 0.41)
  Top 0.406: v114.52,78.69 114.52,48.21 109.44,43.13 v109.44,20.27 | v29.43,20.27 28.16,21.54 v28.16,78.69
  Bottom 0.406: v114.52,78.69 108.17,85.04 96.74,85.04 95.47,83.77 LED1.A | v109.44,20.27 103.09,13.92 100.55,13.92 95.47,19 68.8,19 67.53,20.27 v29.43,20.27 | v28.16,78.69 48.48,78.69 51.02,81.23 R2.2
N$5  (via drill 0.41)
  Top 0.406: C3.2 49.75,29.16 51.02,30.43 51.02,34.24 Q1.2 | v64.99,35.51 64.99,41.86 IC1.9
  Bottom 0.406: v64.99,35.51 63.72,34.24 52.29,34.24 Q1.2
N$6  (via drill 0.41)
  Top 0.406: C4.2 45.94,29.16 45.94,34.24 Q1.1 | v63.72,36.78 63.72,41.86 IC1.10
  Bottom 0.406: v63.72,36.78 49.75,36.78 47.21,34.24 Q1.1
N$7
  Bottom 0.406: Q3.2 84.04,59.64 86.58,57.1 103.09,57.1 104.36,58.37 R3.1
N$8
  Bottom 0.406: Q3.3 81.5,59.64 85.31,55.83 98.01,55.83 105.63,48.21 SG1.-
N$9  (via drill 0.41)
  Top 0.406: v45.94,73.61 45.94,83.77 30.7,83.77 R6.2 | v64.99,64.72 68.8,68.53 X8.3
  Bottom 0.406: v45.94,73.61 54.83,64.72 v64.99,64.72
N$11
  Bottom 0.406: IC2.3 80.23,27.89 81.5,27.89 82.77,26.62 82.77,20.27 98.01,20.27 101.82,16.46 BAT1.1
N$15
  Bottom 0.406: D6.A 23.08,26.62 20.54,29.16 6.57,29.16 X7.4
N$16
  Top 0.406: 24.35,30.43 R10.2
  Bottom 0.406: 34.51,34.24 35.78,34.24 39.59,30.43 Q4.2 | 34.51,34.24 28.16,34.24 24.35,30.43 R10.2 | 34.51,34.24 R8.1
N$17  (via drill 0.41)
  Top 0.406: v66.26,19 67.53,19 71.34,15.19 71.34,12.65 68.8,12.65 JP11.1
  Bottom 0.406: JP2.1 44.67,3.76 43.4,2.49 30.7,2.49 30.7,5.03 S2.1 30.7,6.3 30.7,8.84 40.86,19 v66.26,19
N$18
  Bottom 0.406: Q5.2 131.03,22.81 129.76,24.08 118.33,24.08 117.06,22.81 R11.1
N$19
  Bottom 0.406: Q5.1 132.3,25.35 141.19,25.35 LED2.A
N$20
  Bottom 0.406: LED2.K 141.19,27.89 127.22,27.89 125.95,26.62 R12.2
N$21
  Top 0.406: K1.2 156.43,21.54 147.54,21.54 D1.A
  Bottom 0.406: Q5.3 132.3,19 143.73,19 146.27,21.54 D1.A
N$22
  Top 0.406: D5.A 23.08,22.81 16.73,16.46 J1.1 15.46,15.19 6.57,15.19 X7.1
N$23
  Top 0.406: 33.24,8.84 33.24,12.65 34.51,13.92 34.51,22.81 D5.C | 33.24,8.84 33.24,6.3 S2.2 | 33.24,8.84 45.94,8.84 48.48,6.3 48.48,5.03 JP2.2
  Bottom 0.406: BATT.1 16.73,21.54 18,20.27 26.89,20.27 29.43,22.81 33.24,22.81 D5.C
N$24  (via drill 3 pad 6.45)
  other vias: 181.49,7.38
N$27
  Top 0.406: 24.35,39.32 R15.2
  Bottom 0.406: 34.51,43.13 39.59,43.13 Q6.2 | 34.51,43.13 28.16,43.13 24.35,39.32 R15.2 | 34.51,43.13 R13.1
N$28
  Top 0.406: Q7.2 128.49,36.78 123.41,36.78 123.41,35.51 R16.1
N$29
  Bottom 0.406: Q7.1 128.49,40.59 129.76,39.32 141.19,39.32 LED3.A
N$30
  Bottom 0.406: LED3.K 141.19,41.86 139.92,43.13 125.95,43.13 123.41,40.59 R17.2
N$31
  Bottom 0.406: Q7.3 128.49,34.24 131.03,31.7 143.73,31.7 145,32.97 D2.A 146.27,34.24 151.35,34.24 155.16,38.05 K2.2
N$32
  Top 0.406: 24.35,48.21 R20.2
  Bottom 0.406: Q8.2 39.59,55.83 35.78,52.02 R18.1 34.51,52.02 28.16,52.02 24.35,48.21 R20.2
N$33
  Bottom 0.406: Q9.2 128.49,52.02 127.22,53.29 123.41,53.29 R21.1
N$34
  Bottom 0.406: Q9.1 128.49,54.56 141.19,54.56 LED4.A
N$35
  Bottom 0.406: LED4.K 141.19,57.1 123.41,57.1 120.87,54.56 120.87,52.02 123.41,52.02 124.68,50.75 124.68,46.94 115.79,46.94 113.25,49.48 R22.2
N$36
  Top 0.406: Q9.3 128.49,48.21 134.84,48.21 D3.A
  Bottom 0.406: K3.2 156.43,54.56 153.89,52.02 139.92,52.02 136.11,48.21 D3.A
N$37
  Top 0.406: 24.35,55.83 R25.2
  Bottom 0.406: Q10.2 39.59,68.53 34.51,68.53 R23.1 35.78,67.26 24.35,55.83 R25.2
N$38
  Bottom 0.406: Q11.2 127.22,64.72 114.52,64.72 113.25,63.45 R26.1
N$39
  Bottom 0.406: Q11.1 127.22,67.26 141.19,67.26 LED5.A
N$40
  Bottom 0.406: LED5.K 141.19,69.8 115.79,69.8 113.25,67.26 R27.2
N$41
  Top 0.406: Q11.3 127.22,62.18 133.57,62.18 D4.A
  Bottom 0.406: K4.2 155.16,71.07 148.81,64.72 137.38,64.72 134.84,62.18 D4.A
N$44  (via drill 3 pad 6.45)
  other vias: 180.64,84.05
N$45  (via drill 3 pad 6.45)
  other vias: 14.63,84.66
N$47  (via drill 3 pad 6.45)
  other vias: 6,6.25
N$50  (via drill 0.41)
  Top 0.406: v118.33,8.84 118.33,82.5 108.17,82.5 LED7.A | v63.72,6.3 61.18,8.84 61.18,12.65 JP11.7
  Bottom 0.406: v118.33,8.84 115.79,6.3 v63.72,6.3
N$51  (via drill 0.41)
  Top 0.406: v110.71,48.21 109.44,49.48 109.44,78.69 108.17,79.96 LED7.K | v84.04,21.54 82.77,20.27 v75.15,20.27 | v58.64,21.54 58.64,17.73 61.18,15.19 JP11.8
  Bottom 0.406: v110.71,48.21 115.79,43.13 115.79,29.16 96.74,29.16 89.12,21.54 v84.04,21.54 | v75.15,20.27 68.8,20.27 67.53,21.54 v58.64,21.54
NC1
  Bottom 0.406: X4.3 180.56,25.35 176.75,21.54 169.13,21.54 K1.O
NC2
  Bottom 0.406: X5.2 180.56,40.59 179.29,39.32 169.13,39.32 K2.O
NC3
  Bottom 0.406: X6.1 180.56,57.1 179.29,55.83 169.13,55.83 K3.O
NC4
  Top 0.406: X6.4 180.56,72.34 169.13,72.34 K4.O
NO1
  Bottom 0.406: X4.1 180.56,15.19 175.48,10.11 169.13,10.11 K1.S
NO2
  Bottom 0.406: X4.4 180.56,30.43 176.75,26.62 169.13,26.62 K2.S
NO3
  Bottom 0.406: X5.3 180.56,45.67 178.02,43.13 169.13,43.13 K3.S
NO4
  Bottom 0.406: X6.2 180.56,62.18 179.29,60.91 169.13,60.91 K4.S
PRX
  Top 0.406: JP1.10 70.07,81.23 72.61,81.23 JP8.2
PTX
  Top 0.406: JP1.9 70.07,78.69 72.61,78.69 JP8.1
RST  (via drill 0.41)
  Top 0.406: S1.4 1.49,77.42 1.49,83.77 S1.3 | v87.85,53.29 87.85,44.4 86.58,43.13 IC1.1 | v62.45,53.29 61.18,54.56 v61.18,74.88 63.72,77.42 63.72,78.69 JP1.5
  Bottom 0.406: 24.35,72.34 21.81,74.88 4.03,74.88 1.49,77.42 S1.4 | v62.45,53.29 v87.85,53.29 | 24.35,72.34 29.43,77.42 47.21,77.42 48.48,76.15 57.37,76.15 58.64,74.88 v61.18,74.88 | 24.35,72.34 R1.1
SCL  (via drill 0.41)
  Top 0.406: v81.5,21.54 82.77,22.81 82.77,26.62 84.04,27.89 86.58,27.89 IC2.6 87.85,29.16 90.39,29.16 91.66,30.43 91.66,32.97 87.85,36.78 87.85,43.13 89.12,44.4 89.12,52.02 R5.2
  Bottom 0.406: IC1.28 86.58,50.75 87.85,52.02 89.12,52.02 R5.2 | v81.5,21.54 75.15,21.54 67.53,29.16 IC3.6
SDA  (via drill 0.41)
  Top 0.406: v84.04,54.56 84.04,50.75 IC1.27 | v92.93,54.56 92.93,52.02 R4.2 92.93,50.75 94.2,49.48 94.2,43.13 95.47,41.86 95.47,40.59 94.2,39.32 v94.2,30.43
  Bottom 0.406: v92.93,54.56 v84.04,54.56 | IC3.5 67.53,31.7 68.8,32.97 81.5,32.97 82.77,31.7 86.58,31.7 IC2.5 87.85,30.43 v94.2,30.43
SN1
  Bottom 0.406: R8.2 24.35,35.51 19.27,40.59 6.57,40.59 X2.2
SN2
  Bottom 0.406: R13.2 24.35,44.4 19.27,49.48 6.57,49.48 X2.4
SN3
  Bottom 0.406: R18.2 24.35,52.02 15.46,60.91 6.57,60.91 X3.2
SN4
  Bottom 0.406: R23.2 24.35,67.26 20.54,63.45 4.03,63.45 2.76,64.72 2.76,71.07 5.3,71.07 X3.4
VDD  (via drill 0.41)
  Top 0.406: v30.7,41.86 30.7,78.69 28.16,81.23 R6.3 | v80.23,85.04 80.23,76.15 71.34,76.15 66.26,71.07 66.26,69.8 X8.2
  Bottom 0.406: v30.7,41.86 35.78,41.86 39.59,38.05 43.4,38.05 45.94,40.59 R7.2 | v80.23,85.04 34.51,85.04 30.7,81.23 28.16,81.23 R6.3
VSS  (via drill 0.41)
  Top 0.406: v38.32,76.15 33.24,81.23 R6.1
  Bottom 0.406: 71.34,65.99 66.26,65.99 63.72,68.53 X8.1 63.72,69.8 59.91,69.8 54.83,74.88 48.48,74.88 47.21,76.15 v38.32,76.15 | 71.34,65.99 73.88,68.53 X8.5 | 71.34,65.99 99.28,65.99 101.82,68.53 X8.16

### Text on the board
Top: SG44 | V3.3 | 240513 | NpN Automation Technologies | Pvt. Ltd. Indore
Bottom: SG44 | V3.3 | 240513 | NpN Automation Technologies | Pvt. Ltd. Indore